# EAGLE design DC30_Cnet_FluxCapacitor (EAGLE 9.6.2)
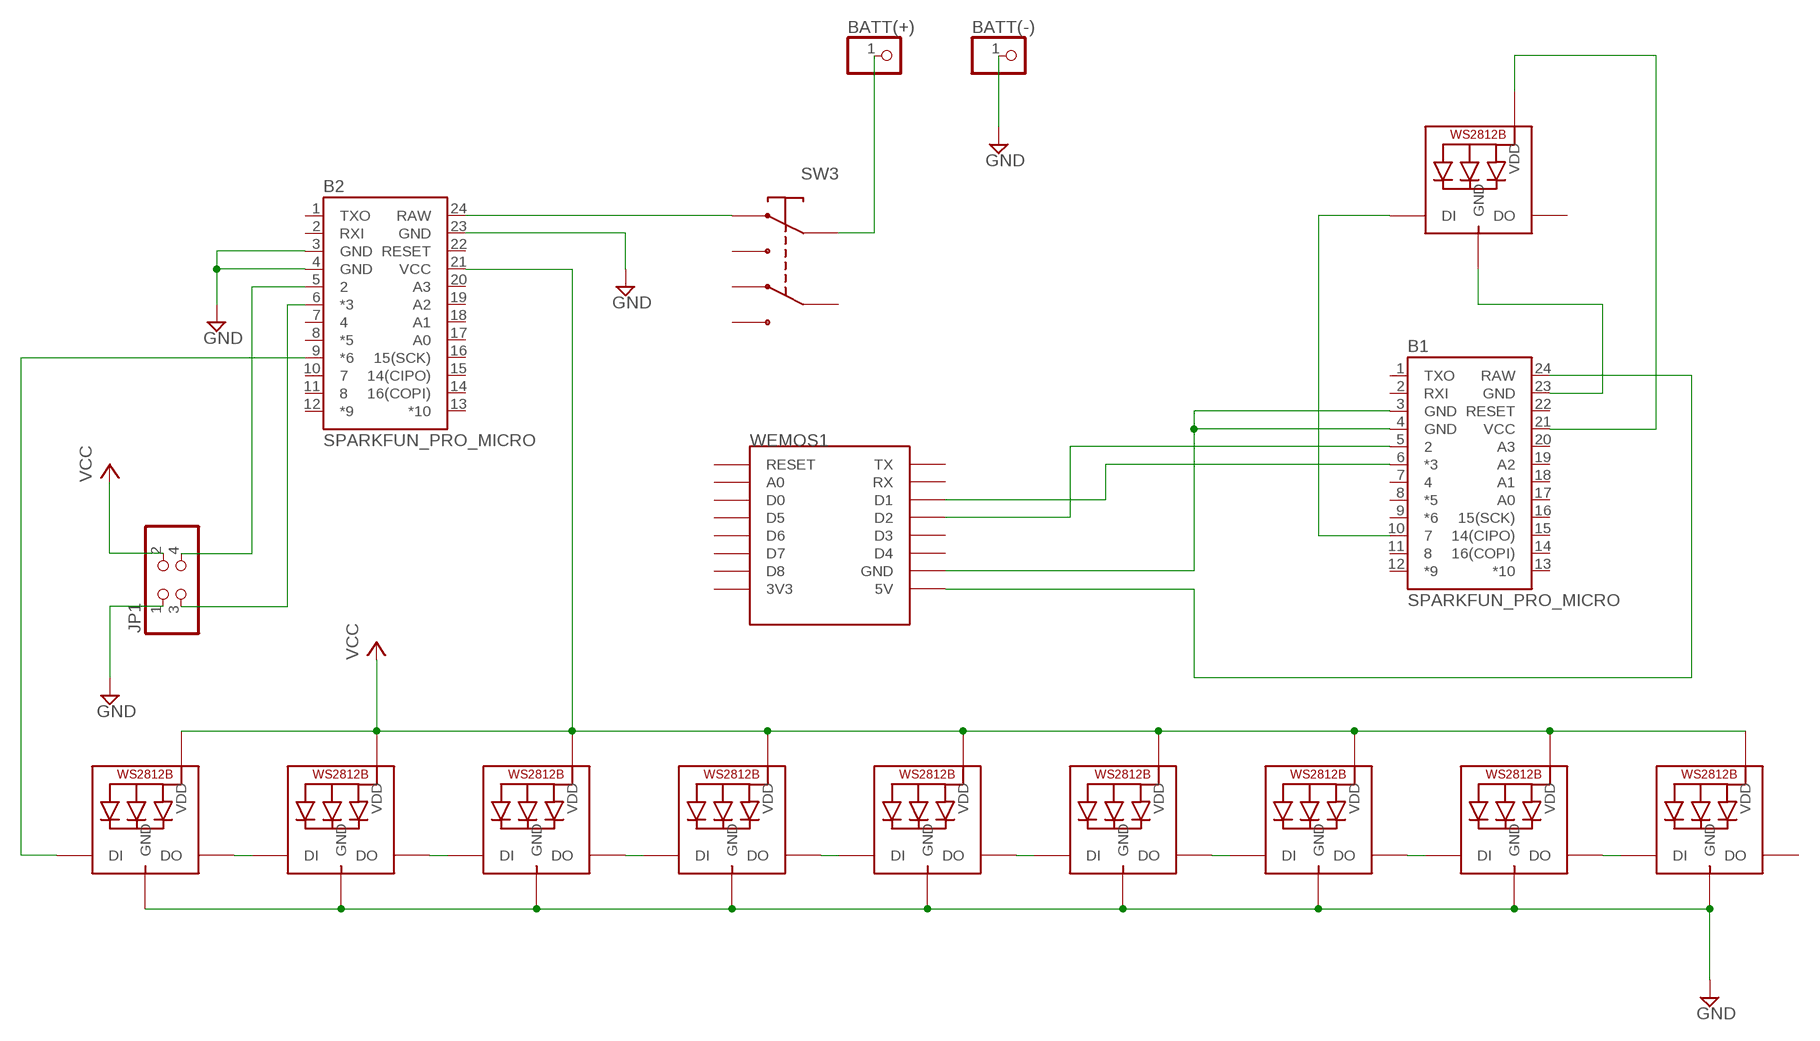
[diagram p0: schematic, sheet 1]

## Parts
B1  SPARKFUN_PRO_MICRO  [SPARKFUN_PRO_MICRO]
B2  SPARKFUN_PRO_MICRO  [SPARKFUN_PRO_MICRO]
BATT(+)  PINHD-1X1  [1X01]
BATT(-)  PINHD-1X1  [1X01]
JP1  PINHD-2X2  [2X02]
LED1  WS2812B5050  [WS2812B]
LED2  WS2812B5050  [WS2812B]
LED3  WS2812B5050  [WS2812B]
LED4  WS2812B5050  [WS2812B]
LED5  WS2812B5050  [WS2812B]
LED6  WS2812B5050  [WS2812B]
LED7  WS2812B5050  [WS2812B]
LED8  WS2812B5050  [WS2812B]
LED9  WS2812B5050  [WS2812B]
LED10  WS2812B5050  [WS2812B]
SW3  JS202011AQN  [JS202011AQN]
WEMOS1  WEMOS-D1-MINI  [WEMOS-D1-MINI]

## Nets
GND: B2.3(GND) B2.4(GND) B2.23(GND) BATT(-).1 JP1.1 LED1.3-GND(GND) LED2.3-GND(GND) LED3.3-GND(GND) LED4.3-GND(GND) LED5.3-GND(GND) LED6.3-GND(GND) LED7.3-GND(GND) LED8.3-GND(GND) LED9.3-GND(GND)
N$1: B1.10 LED10.4-DIN(DI)
N$2: BATT(+).1 SW3.P$2
N$3: B2.9(*6) LED1.4-DIN(DI)
N$4: LED1.2-DOUT(DO) LED2.4-DIN(DI)
N$5: LED2.2-DOUT(DO) LED3.4-DIN(DI)
N$6: LED3.2-DOUT(DO) LED4.4-DIN(DI)
N$7: LED4.2-DOUT(DO) LED5.4-DIN(DI)
N$8: LED5.2-DOUT(DO) LED6.4-DIN(DI)
N$9: LED6.2-DOUT(DO) LED7.4-DIN(DI)
N$10: LED7.2-DOUT(DO) LED8.4-DIN(DI)
N$11: LED8.2-DOUT(DO) LED9.4-DIN(DI)
N$12: B2.5 JP1.4
N$13: B1.3(GND) B1.4(GND) WEMOS1.GND
N$14: B1.24(RAW) WEMOS1.5V
N$15: B1.23(GND) LED10.3-GND(GND)
N$16: B1.21(VCC) LED10.1-VDD(VDD)
N$17: B1.5 WEMOS1.D2
N$18: B1.6(*3) WEMOS1.D1
N$19: B2.6(*3) JP1.3
N$20: B2.24(RAW) SW3.P$1
VCC: B2.21(VCC) JP1.2 LED1.1-VDD(VDD) LED2.1-VDD(VDD) LED3.1-VDD(VDD) LED4.1-VDD(VDD) LED5.1-VDD(VDD) LED6.1-VDD(VDD) LED7.1-VDD(VDD) LED8.1-VDD(VDD) LED9.1-VDD(VDD)
Unconnected: B1.1(TXO) B1.2(RXI) B1.7 B1.8(*5) B1.9(*6) B1.11 B1.12(*9) B1.13(*10) B1.14(16(COPI)) B1.15(14(CIPO)) B1.16(15(SCK)) B1.17(A0) B1.18(A1) B1.19(A2) B1.20(A3) B1.22(RESET) B2.1(TXO) B2.2(RXI) B2.7 B2.8(*5) B2.10 B2.11 B2.12(*9) B2.13(*10) B2.14(16(COPI)) B2.15(14(CIPO)) B2.16(15(SCK)) B2.17(A0) B2.18(A1) B2.19(A2) B2.20(A3) B2.22(RESET) LED9.2-DOUT(DO) LED10.2-DOUT(DO) SW3.P$3 SW3.P$4 SW3.P$5 SW3.P$6 WEMOS1.3V3 WEMOS1.A0 WEMOS1.D0 WEMOS1.D3 WEMOS1.D4 WEMOS1.D5 WEMOS1.D6 WEMOS1.D7 WEMOS1.D8 WEMOS1.RESET WEMOS1.RX WEMOS1.TX

## Library data of the parts
B1 B2 = SparkFun-Boards:SPARKFUN_PRO_MICRO: SparkFun Pro Micro Atmega32U4 compatible footprint. SparkFun Products: 3.3V/8MHz <https://www.sparkfun.com/products/12587> 5V/16MHz <https://www.sparkfun.com/products/12640>
BATT(+) BATT(-) = pinhead:PINHD-1X1: PIN HEADER
JP1 = pinhead:PINHD-2X2: PIN HEADER
LED1-LED10 = adafruit:WS2812B
SW3 = macetech:JS202011AQN
WEMOS1 = esp8266modules:WEMOS-D1-MINI: WeMos.cc D1 mini ESP8266 module

## Board
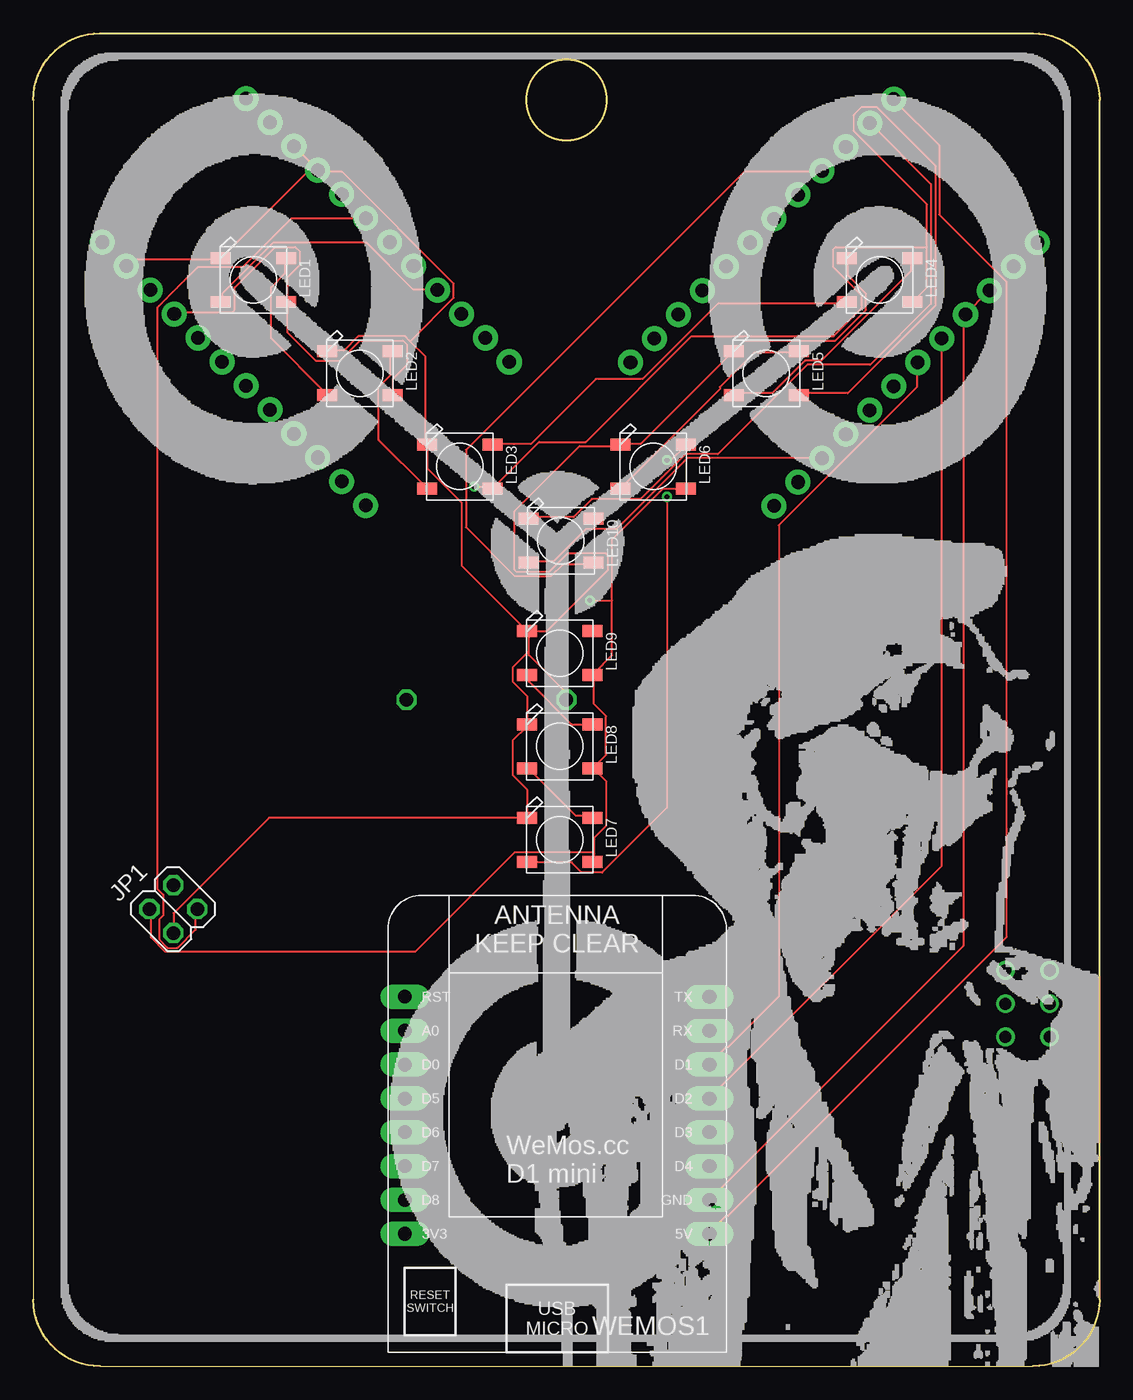
[diagram p1: board, top side]
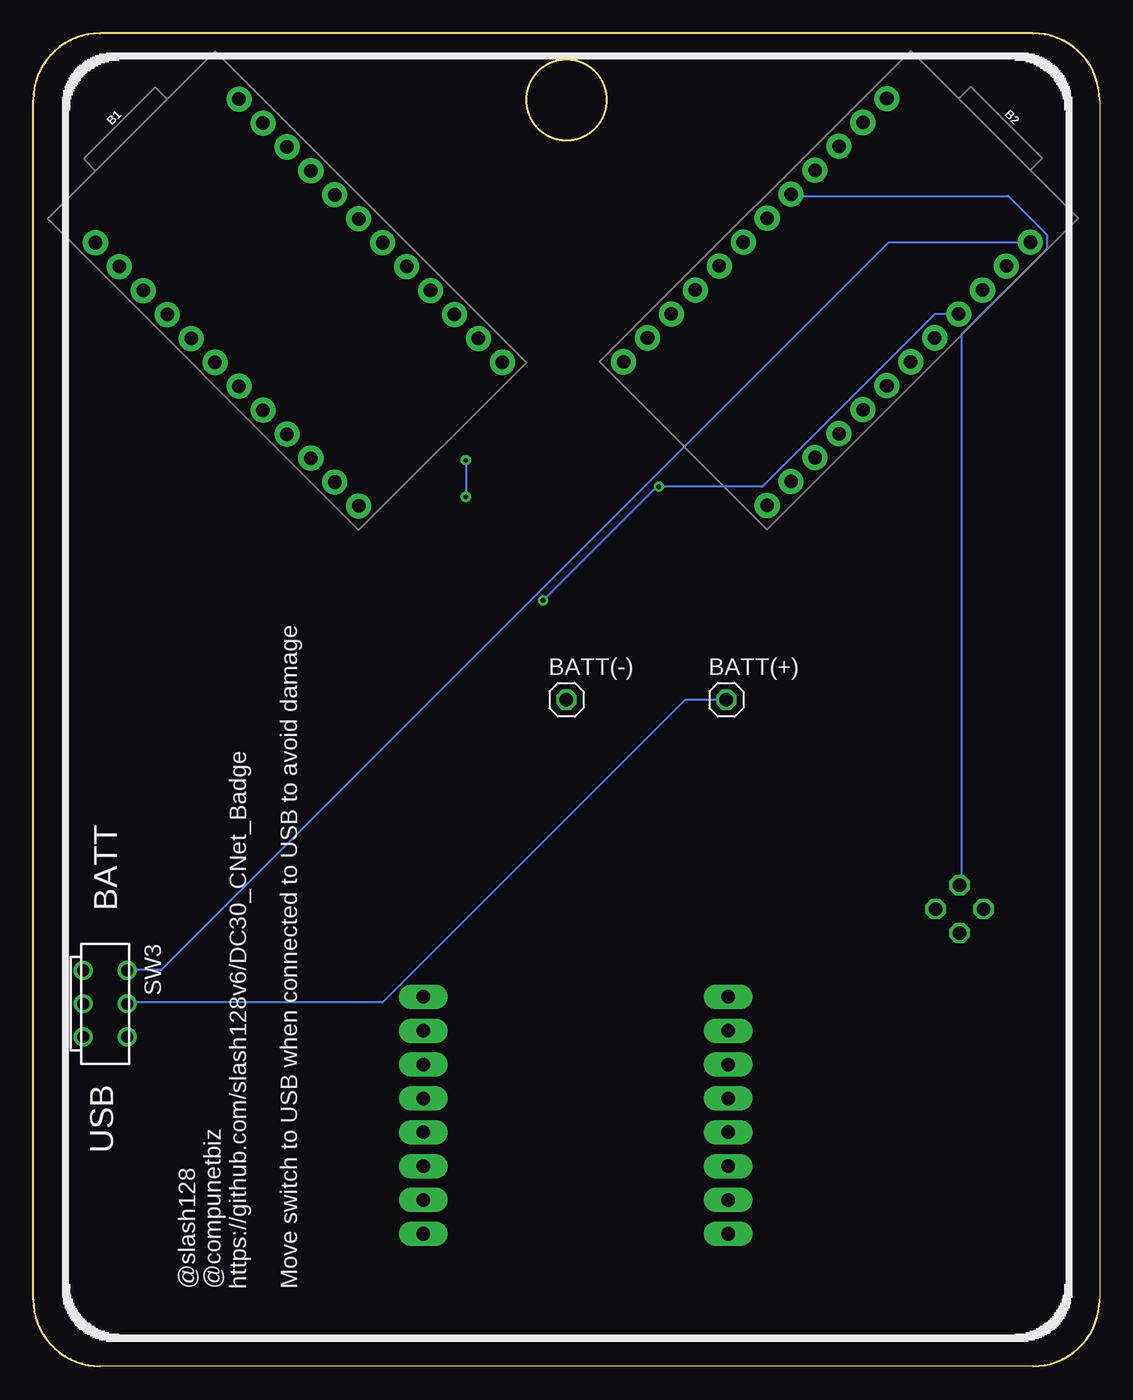
[diagram p2: board, bottom side, seen from below]

Size 80 x 100 mm. Coordinates in mm from the lower left corner, seen from the top.
Outline: 5,0 75,0 arc90 80,5 80,95 arc90 75,100 5,100 arc90 0,95 0,5 arc90 5,0
Outline: circle at 40,95 radius 3
Copper layers (1*16): Top 0.035mm / dielectric 1.5mm / Bottom 0.035mm
Design rules "default": minimum track width 6mil, minimum drill 0.35mm, track to track 6mil, track to pad 6mil, pad to pad 6mil, via to via 6mil, smd to smd 6mil, copper to edge 40mil, drill to drill 6mil, minimum pad ring 10mil, minimum via ring 8mil, stop-mask expansion 4mil, vias tented up to drill 0mil, thermal gap 10mil

### Footprints (pad centres in the part's own frame; a part is rotated, then mirrored left to right if it is on the bottom)
SPARKFUN_PRO_MICRO = drill 1.016 pad 1.88: 1 -7.62,12.7; 2 -7.62,10.16; 3 -7.62,7.62; 4 -7.62,5.08; 5 -7.62,2.54; 6 -7.62,0; 7 -7.62,-2.54; 8 -7.62,-5.08; 9 -7.62,-7.62; 10 -7.62,-10.16; 11 -7.62,-12.7; 12 -7.62,-15.24; 13 7.62,-15.24; 14 7.62,-12.7; 15 7.62,-10.16; 16 7.62,-7.62; 17 7.62,-5.08; 18 7.62,-2.54; 19 7.62,0; 20 7.62,2.54; 21 7.62,5.08; 22 7.62,7.62; 23 7.62,10.16; 24 7.62,12.7
1X01 = drill 1.016 octagon: 1 0,0
2X02 = drill 1.016 octagon: 1 -1.27,-1.27; 2 -1.27,1.27; 3 1.27,-1.27; 4 1.27,1.27
WS2812B = smd 1.5 x 0.9: 1-VDD 2.45,-1.65; 2-DOUT 2.45,1.65; 3-GND -2.45,1.65; 4-DIN -2.45,-1.65
JS202011AQN = drill 0.9: P$1 -2.5,1.65; P$2 0,1.65; P$3 2.5,1.65; P$4 -2.5,-1.65; P$5 0,-1.65; P$6 2.5,-1.65
WEMOS-D1-MINI = drill 1.016 pad 1.829 long: 3V3 -10.16,-10.16; 5V 12.7,-10.16; A0 -10.16,5.08; D0 -10.16,2.54; D1 12.7,2.54; D2 12.7,0; D3 12.7,-2.54; D4 12.7,-5.08; D5 -10.16,0; D6 -10.16,-2.54; D7 -10.16,-5.08; D8 -10.16,-7.62; GND 12.7,-7.62; RESET -10.16,7.62; RX 12.7,5.08; TX 12.7,7.62

### Placement (x,y rotation side)
B1  60.97,80.7 45 bottom
B2  19.55,80.74 315 bottom
BATT(+)  28,50 0 bottom
BATT(-)  40,50 0 bottom
JP1  10.5,34.3 45 top
LED1  16.5,81.5 0 top
LED2  24.5,74.5 0 top
LED3  32,67.5 0 top
LED4  63.5,81.5 0 top
LED5  55,74.5 0 top
LED6  46.5,67.5 0 top
LED7  39.5,39.5 0 top
LED8  39.5,46.5 0 top
LED9  39.5,53.5 0 top
LED10  39.59,61.93 0 top
SW3  74.6,27.2 270 bottom
WEMOS1  38.03,20.09 0 top

### Tracks (layer width: path | path; a pad name or v marks a point on that pad's centre or on a via)
GND
  Top 0.152: LED4.3-GND 61.11,83.06 61.11,81.84 62.48,80.47 62.48,79.25 60.2,76.96 53.34,76.96 52.58,76.2 LED5.3-GND 52.43,76.05 45.57,69.19 44.2,69.19 LED6.3-GND 44.04,69.04 41,69.04 36.12,64.16 36.12,59.74 36.27,59.59 38.71,59.59 40.08,60.96 42.98,60.96 43.13,60.81 43.13,59.74 38.56,55.17 37.19,55.17 LED9.3-GND | 21.03,90.07 21.34,89.76 B2.4 | 21.03,90.07 19.66,91.44 B2.3 | B2.23 7.01,82.6 7.47,83.06 14.02,83.06 LED1.3-GND 14.17,83.21 21.03,90.07 | 21.03,90.07 B2.4 | 28.19,76.96 29.41,75.74 29.41,69.19 LED3.3-GND 29.57,69.04 29.57,67.36 32.16,64.77 32.16,60.05 37.03,55.17 LED9.3-GND | 28.19,76.96 27.89,77.27 24.38,77.27 23.32,76.2 22.1,76.2 LED2.3-GND | 37.19,53.65 37.19,53.34 39.93,50.6 39.93,50.14 BATT(-).1 | 37.19,53.65 37.19,55.02 LED9.3-GND | 37.19,53.65 35.97,52.43 35.97,51.36 37.03,50.29 37.03,48.16 LED8.3-GND 37.03,48.01 35.97,46.94 35.97,44.35 37.03,43.28 37.03,41.3 LED7.3-GND 37.03,41.15 17.68,41.15 10.52,33.98 10.52,32.61 JP1.1 | 28.19,76.96 28.35,76.96 31.55,80.16 31.55,81.23 23.16,89.61 21.49,89.61 B2.4
N$1
  Top 0.152: LED10.4-DIN 37.19,60.35 39.01,60.35 41.45,62.79 43.74,62.79 49.07,68.12 59.13,68.12 B1.10
N$2
  Bottom 0.152: SW3.P$2 72.85,27.28 53.8,27.28 31.09,49.99 28.04,49.99 BATT(+).1
N$3
  Top 0.152: LED1.4-DIN 14.17,79.86 14.17,80.47 17.98,84.28 24.99,84.28 28.5,80.77 30.18,80.77 B2.9
N$4
  Top 0.152: LED1.2-DOUT 18.9,83.06 18.9,81.99 17.83,80.92 17.83,77.11 21.95,73 LED2.4-DIN
N$5
  Top 0.152: LED2.2-DOUT 26.82,76.05 26.82,74.37 25.91,73.46 25.91,69.49 29.41,65.99 LED3.4-DIN
N$6
  Top 0.152: LED3.2-DOUT 34.59,69.19 37.34,69.19 42.22,74.07 45.72,74.07 51.36,79.7 60.96,79.7 LED4.4-DIN
N$7
  Top 0.152: LED5.4-DIN 52.58,73 55.47,73 57.91,75.44 59.13,75.44 65.84,82.14 65.84,83.06 LED4.2-DOUT
N$8
  Top 0.152: LED6.4-DIN 44.2,65.99 51.51,73.3 51.51,73.46 54.1,76.05 57.3,76.05 LED5.2-DOUT
N$9  (via drill 0.35)
  Top 0.152: v47.55,65.23 47.55,41.91 42.67,37.03 41.15,37.03 40.39,37.8 37.19,37.8 LED7.4-DIN | v47.55,67.97 47.85,67.97 48.92,69.04 LED6.2-DOUT
  Bottom 0.152: v47.55,67.97 v47.55,65.23
N$10
  Top 0.152: LED7.2-DOUT 41.91,41.3 40.69,41.3 37.19,44.81 LED8.4-DIN
N$11
  Top 0.152: LED8.2-DOUT 41.91,48.16 40.39,48.16 37.19,51.36 37.19,51.82 LED9.4-DIN
N$12
  Bottom 0.152: JP1.4 10.36,36.12 10.36,77.42 3.96,83.82 3.96,84.89 6.86,87.78 23.01,87.78 B2.5
N$13
  Top 0.152: WEMOS1.GND 50.75,12.5 69.8,31.55 69.8,78.79 B1.4 69.95,78.94 71.63,80.62 B1.3
N$14
  Top 0.152: WEMOS1.5V 50.75,10.06 51.97,11.28 52.12,11.28 73,32.16 73,81.38 67.97,86.41 67.97,91.59 64.62,94.94 B1.24
N$15
  Top 0.152: LED10.3-GND 37.19,63.7 40.54,63.7 41.91,65.08 45.57,65.08 48.92,68.43 51.36,68.43 58.06,75.13 62.79,75.13 67.36,79.7 67.36,88.7 62.79,93.27 B1.23
N$16
  Top 0.152: LED10.1-VDD 41.91,60.2 39.78,60.2 38.86,59.28 36.12,59.28 32.46,62.94 32.46,68.73 53.34,89.61 59.13,89.61 B1.21
N$17
  Top 0.152: WEMOS1.D2 50.75,20.12 68.12,37.49 68.12,76.96 B1.5
N$18
  Top 0.152: WEMOS1.D1 50.75,22.71 51.97,23.93 52.12,23.93 55.93,27.74 55.93,63.09 66.29,73.46 66.29,75.29 B1.6
N$19
  Top 0.152: JP1.3 12.19,34.29 12.19,32.77 10.82,31.39 10.06,31.39 9.45,32 9.45,33.53 9.75,33.83 9.75,35.36 9.3,35.81 9.3,79.4 12.34,82.45 15.7,82.45 19.36,86.11 24.84,86.11 B2.6
N$20
  Bottom 0.152: SW3.P$1 72.85,29.72 70.41,29.72 15.85,84.28 5.18,84.28 B2.24
VCC  (via drill 0.35)
  Top 0.152: 42.06,38.56 42.06,39.62 42.98,40.54 42.98,43.89 42.06,44.81 LED8.1-VDD 42.06,44.96 42.98,45.87 42.98,48.77 42.06,49.68 42.06,51.82 LED9.1-VDD 42.06,51.97 43.43,53.34 43.43,57.45 | 42.06,38.56 42.06,37.95 LED7.1-VDD | 43.43,57.45 43.43,62.03 47.24,65.84 48.92,65.84 LED6.1-VDD | 67.06,83.97 67.06,80.92 65.99,79.86 LED4.1-VDD | 67.06,83.97 67.06,87.17 61.57,92.66 61.57,93.88 62.18,94.49 63.25,94.49 67.67,90.07 67.67,79.55 61.11,73 57.45,73 LED5.1-VDD | LED2.1-VDD 26.98,73 26.98,74.07 28.04,75.13 28.04,76.66 27.74,76.96 24.54,76.96 23.01,75.44 21.18,75.44 19.05,77.57 19.05,79.7 LED1.1-VDD 19.05,79.86 19.05,81.69 19.96,82.6 19.96,83.67 19.66,83.97 18.14,83.97 15.09,80.92 15.09,79.25 14.94,79.1 10.67,79.1 B2.21 | v33.07,65.99 34.44,65.99 LED3.1-VDD 34.59,65.99 37.95,69.34 41.45,69.34 49.38,77.27 60.05,77.27 62.18,79.4 62.18,80.31 60.05,82.45 60.05,83.82 60.2,83.97 67.06,83.97 | v41.76,57.45 43.43,57.45 | 42.06,38.56 36.12,38.56 28.65,31.09 9.91,31.09 8.84,32.16 8.84,34.29 JP1.2
  Bottom 0.152: B2.21 10.67,78.94 12.34,78.94 25.3,65.99 v33.07,65.99 33.22,65.99 v41.76,57.45

### Text on the board
bPlace: BATT | USB | @slash128 / @compunetbiz / https://github.com/slash128v6/DC30_CNet_Badge / / Move switch to USB when connected to USB to avoid damage